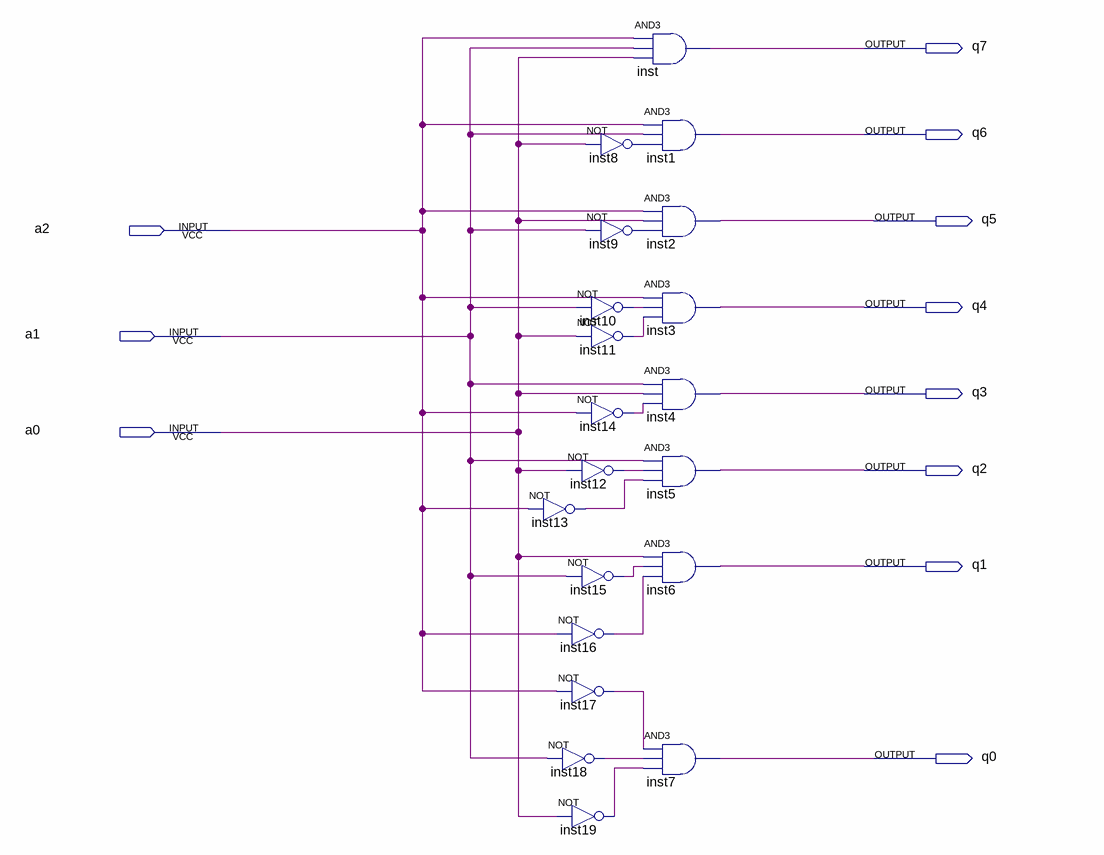
[diagram p0: schematic sheet]
// Quartus schematic 3_8.bdf as structural Verilog: 20 symbols, 11 pins
module \3_8  (
  input  a2,
  input  a1,
  input  a0,
  output q7,
  output q6,
  output q5,
  output q4,
  output q3,
  output q2,
  output q1,
  output q0
);

  wire inst8_out, inst9_out, inst10_out, inst11_out, inst12_out, inst13_out, inst14_out, inst15_out,
       inst16_out, inst17_out, inst18_out, inst19_out;

  not inst10 (inst10_out, a1);
  not inst11 (inst11_out, a0);
  not inst14 (inst14_out, a2);
  not inst12 (inst12_out, a0);
  not inst13 (inst13_out, a2);
  not inst15 (inst15_out, a1);
  not inst16 (inst16_out, a2);
  not inst17 (inst17_out, a2);
  not inst18 (inst18_out, a1);
  not inst19 (inst19_out, a0);
  and inst (q7, a2, a1, a0);
  and inst1 (q6, a2, a1, inst8_out);
  not inst8 (inst8_out, a0);
  and inst2 (q5, a2, a0, inst9_out);
  not inst9 (inst9_out, a1);
  and inst3 (q4, a2, inst10_out, inst11_out);
  and inst4 (q3, a1, a0, inst14_out);
  and inst5 (q2, a1, inst12_out, inst13_out);
  and inst6 (q1, a0, inst15_out, inst16_out);
  and inst7 (q0, inst17_out, inst18_out, inst19_out);
endmodule
